# Altium project PiZeroDaughterBoard.PrjPcb
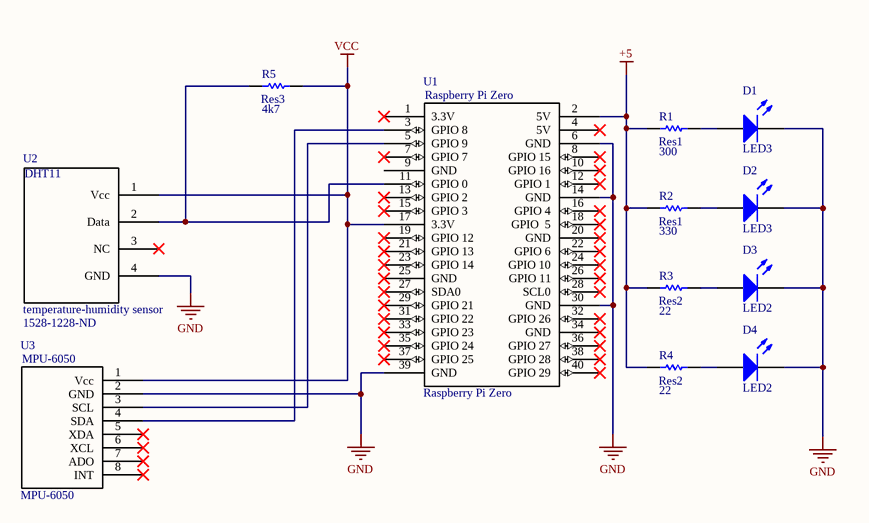
[diagram p0: PiZeroDaughterBoardScamatic.SchDoc]
1 sheet, 12 parts. Net scope: global (net labels, ports and power ports of the same name join across sheets).
Board file: PCBDaughterBoard.PcbDoc

## Sheet PiZeroDaughterBoardScamatic.SchDoc
size A4

### Parts
D1  LED3  [LEDRD254W57D500H1070]
D2  LED3  [LEDRD254W57D500H1070]
D3  LED2  [LEDRD254W57D500H1070]
D4  LED2  [LEDRD254W57D500H1070]
R1  Res1  value 300  [AXIAL-0.3]
R2  Res1  value 330  [AXIAL-0.3]
R3  Res2  value 22  [AXIAL-0.3]
R4  Res2  value 22  [AXIAL-0.3]
R5  Res3  value 4k7  [AXIAL-0.3]
U1  Raspberry Pi Zero  [ADA3708_RPI-ZERO]
U2  temperature-humidity sensor  Supplier Part Number 1: 1528-1228-ND  [NPSIP4A]
U3  MPU-6050  [HDR1X8H]

### Nets
+5: R1.1 R2.1 R3.1 R4.1 U1.2(5V)
GND: D1.2(K) D2.2(K) D3.2(K) D4.2(K) U1.6(GND) U1.14(GND) U1.30(GND) U1.39(GND) U2.4(GND) U3.2(GND)
VCC: R5.2 U1.17(3.3V) U2.1(Vcc) U3.1(Vcc)
NetD1_1: D1.1(A) R1.2
NetD2_1: D2.1(A) R2.2
NetD3_1: D3.1(A) R3.2
NetD4_1: D4.1(A) R4.2
NetR5_1: R5.1 U1.11(GPIO_0) U2.2(Data)
NetU1_3: U1.3(GPIO_8) U3.4(SDA)
NetU1_5: U1.5(GPIO_9) U3.3(SCL)

Not connected (* = marked no-connect by the designer): U1 1(3.3V)* 4(5V)* 7(GPIO_7)* 8(GPIO_15)* 9(GND) 10(GPIO_16)* 12(GPIO_1)* 13(GPIO_2)* 15(GPIO_3)* 16(GPIO_4)* 18(GPIO__5)* 19(GPIO_12)* 20(GND)* 21(GPIO_13)* 22(GPIO_6)* 23(GPIO_14)* 24(GPIO_10)* 25(GND)* 26(GPIO_11)* 27(SDA0)* 28(SCL0)* 29(GPIO_21)* 31(GPIO_22)* 32(GPIO_26)* 33(GPIO_23)* 34(GND)* 35(GPIO_24)* 36(GPIO_27)* 37(GPIO_25)* 38(GPIO_28)* 40(GPIO_29)*; U2 3(NC)*; U3 5(XDA)* 6(XCL)* 7(ADO)* 8(INT)*

### Library data of the parts
D1 D2 = LED3: Typical BLUE SiC LED; pin to pad: 1>A 2>C; Published: 8-Jun-2000; LatestRevisionDate: 17-Dec-2003; LatestRevisionNote: PCB Footprint replaced.; DatasheetVersion: 16-Apr-2002; PackageVersion: 16-Apr-2002; PackageReference: 3.5X2.8X1.9; Publisher: Altium Limited; PackageDescription: SM LED; 2 C-Bend Leads; Body 3.5 x 2.8 x 1.9 mm, inc leads (LxWxH typ)
D3 D4 = LED2: GREEN LED; pin to pad: 1>A 2>C; Published: 8-Jun-2000; LatestRevisionDate: 17-Jul-2002; LatestRevisionNote: Re-released for DXP Platform.; PackageVersion: Feb-2002; PackageReference: 3.2X1.6X1.1; Publisher: Altium Limited; PackageDescription: SM LED; 2 Flat Leads
R1-R5 = Res1: Resistor; Published: 8-Jun-2000; LatestRevisionDate: 17-Jul-2002; LatestRevisionNote: Re-released for DXP Platform.; PackageReference: AXIAL-0.3; Publisher: Altium Limited; PackageDescription: Axial Device, Thru-Hole; 2 Leads; 0.3 in Pin Spacing
U2 = DHT11: temperature-humidity sensor In out of Vcc, DQ, NC, GND; Manufacturer 1: Adafruit Industries; Manufacturer Part Number 1: 386; Response Time: 1s; Accuracy: 5%; Output Type: Digital; Supplier 1: Digi-Key; Stock 1: 312; RoHS: Yes; Mount: Chassis Mount; Min Operating Temperature: 0°C; Max Operating Temperature: 50°C; Series: -; Sensor Type: Temperature; ComponentLink1URL: https://media.digikey.com/pdf/Data%20Sheets/Adafruit%20PDFs/DHT11_ProdManual.pdf?src-supplier=Digi-Key; ComponentLink1Description: https://media.digikey.com/pdf/Data%20Sheets/Adafruit%20PDFs/DHT11_ProdManual.pdf?src-supplier=Digi-Key
U3 = MPU-6050: 3-axis Gyroscope, 3-axis Accelerometer.